# Altium schematic sheet ERN_MainPowerV2_2.SchDoc
size A; SheetNumber: 2; SheetTotal: 2; SPICEModelCacheXTMDSSOX: <root> / <DocumentId>XTMDSSOX</DocumentId> / <CacheFrame Number="0"> / <Model Name="led2" Kind="MDL"> / <Text>*Typ RED,GREEN,YELLOW,AMBER GaAs LED: Vf=2.1V Vr=4V If=40mA trr=3uS / *LED Pinout: 1=A, 2=K / .MODEL LED2 D (IS=93.1P RS=42M N=4.61 BV=4 IBV=10U / + CJO=2.97P VJ=.75 M=.333 TT=4.32U)</Text> / </Model> / <Model Name="1n5406" Kind="MDL"> / <Text>*1N5406 MCE / *600V 3A Si Rectifier pkg:DO-201 1,2 / .MODEL 1N5406 D(IS=2.68E-12 RS=0.00731 N=1.17 TT=1.44E-5 CJO=1.24E-10 / + VJ=0.6 M=0.333 BV=900 IBV=1E-5 )</Text> / </Model> / </CacheFrame> / </root>
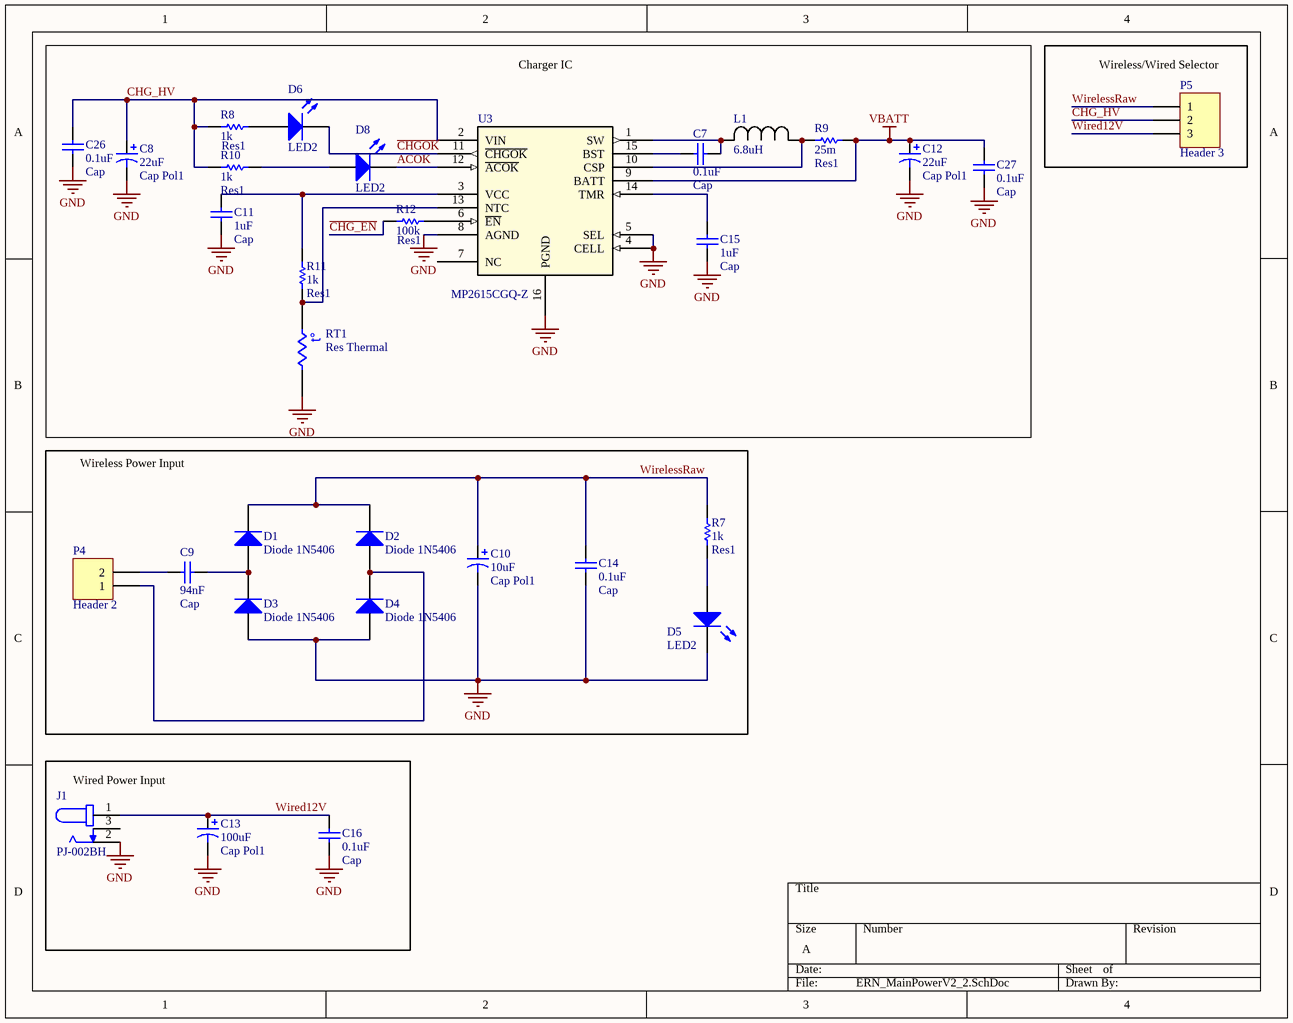
[diagram p0: ERN_MainPowerV2_2.SchDoc]

## Parts
C7  Cap  value 0.1uF  [C0805]
C8  Cap Pol1  value 22uF  [Cap_47uF_100uF]
C9  Cap  value 94nF  [C1210]
C10  Cap Pol1  value 10uF  [Cap_47uF_100uF]
C11  Cap  value 1uF  [C0805]
C12  Cap Pol1  value 22uF  [Cap_47uF_100uF]
C13  Cap Pol1  value 100uF  [Cap_47uF_100uF]
C14  Cap  value 0.1uF  [RAD-0.3]
C15  Cap  value 1uF  [C0805]
C16  Cap  value 0.1uF  [RAD-0.3]
C26  Cap  value 0.1uF  [C0805]
C27  Cap  value 0.1uF  [rad-0.3]
D1  Diode 1N5406  [DO-201AD]
D2  Diode 1N5406  [DO-201AD]
D3  Diode 1N5406  [DO-201AD]
D4  Diode 1N5406  [DO-201AD]
D5  LED2  [led-0]
D6  LED2  [led-0]
D8  LED2  [led-0]
J1  PJ-002BH  [CUI_PJ-002BH]
L1  6.8uH  [IND_VLS6045EX-6R8M]
P4  Header 2  [HDR1X2]
P5  Header 3  [HDR1X3]
R7  Res1  value 1k  [AXIAL-0.3]
R8  Res1  value 1k  [AXIAL-0.3]
R9  Res1  value 25m  [RESC6432X90N]
R10  Res1  value 1k  [AXIAL-0.3]
R11  Res1  value 1k  [AXIAL-0.3]
R12  Res1  value 100k  [AXIAL-0.3]
RT1  Res Thermal  [AXIAL-0.3]
U3  MP2615CGQ-Z  [QFN-16_3MM×3MM_MNP_MPS]

## Blocks framed on the sheet
Charger IC: C7 C8 C11 C12 C15 C26 C27 D6 D8 L1 R8-R12 RT1 U3
Wireless/Wired Selector: P5
Wireless Power Input: C9 C10 C14 D1-D5 P4 R7
Wired Power Input: C13 C16 J1

## Nets
GND: C8.2 C10.2 C11.1 C12.2 C13.2 C14.2 C15.2 C16.2 C26.1 C27.2 D3.1(A) D4.1(A) D5.2(K) J1.2 RT1.2 U3.4(CELL) U3.5(SEL) U3.8(AGND) U3.16(PGND)
VBATT: C12.1 C27.1 R9.2 U3.9(BATT)
~{ACOK}: D8.2(K) U3.12(~{ACOK})
~{CHG_EN}: R12.2
~{CHGOK}: D6.2(K) U3.11(~{CHGOK})
CHG_HV: C8.1 C26.2 P5.2 R8.2 R10.2 U3.2(VIN)
Wired12V: C13.1 C16.1 J1.1 P5.3
WirelessRaw: C10.1 C14.1 D1.2(K) D2.2(K) P5.1 R7.2
NetC7_1: C7.1 U3.15(BST)
NetC7_2: C7.2 L1.2 U3.1(SW)
NetC9_1: C9.1 P4.2
NetC9_2: C9.2 D1.1(A) D3.2(K)
NetC11_2: C11.2 R11.1 U3.3(VCC)
NetC15_1: C15.1 U3.14(TMR)
NetD2_1: D2.1(A) D4.2(K) P4.1
NetD5_1: D5.1(A) R7.1
NetD6_1: D6.1(A) R8.1
NetD8_1: D8.1(A) R10.1
NetL1_1: L1.1 R9.1 U3.10(CSP)
NetR11_2: R11.2 RT1.1 U3.13(NTC)
NetR12_1: R12.1 U3.6(~{EN})

Not connected (* = marked no-connect by the designer): J1 3; U3 7(NC)

## Notes on the sheet
- (in symbol Res Thermal) t°

## Library data of the parts
C7 C9 C11 C14-C16 C26 C27 = Cap: Capacitor; Published: 8-Jun-2000; LatestRevisionDate: 17-Jul-2002; LatestRevisionNote: Re-released for DXP Platform.; PackageReference: RAD-0.3; Publisher: Altium Limited; PackageDescription: Radial Cap, Thru-Hole; 2 Leads; 0.3 in Pin Spacing
C8 C10 C12 C13 = Cap Pol1: Polarized Capacitor (Radial); Published: 8-Jun-2000; LatestRevisionDate: 17-Jul-2002; LatestRevisionNote: Re-released for DXP Platform.; PackageReference: RB7.6-15; Publisher: Altium Limited; PackageDescription: Polarized Capacitor (Radial); 2 Leads
D1-D4 = Diode 1N5406: 3 Amp General Purpose Rectifier; Published: 8-Jun-2000; LatestRevisionDate: 17-Jul-2002; LatestRevisionNote: Re-released for DXP Platform.; DatasheetVersion: 1998; PackageVersion: Aug-1999; PackageReference: DO-201AD; Publisher: Altium Limited; PackageDescription: Diode, Axial; Body 9.5 x 5.6 mm (LxDia. max), Lead Dia. 1.32 mm (max); ComponentLink1Description: Manufacturer Link; ComponentLink1URL: http://www.fairchildsemi.com/; ComponentLink2Description: Datasheet; ComponentLink2URL: http://www.fairchildsemi.com/ds/1N%2F1N5400.pdf
D5 D6 D8 = LED2: Typical RED, GREEN, YELLOW, AMBER GaAs LED; Published: 8-Jun-2000; LatestRevisionDate: 17-Jul-2002; LatestRevisionNote: Re-released for DXP Platform.; PackageVersion: Feb-2002; PackageReference: 3.2X1.6X1.1; Publisher: Altium Limited; PackageDescription: SM LED; 2 Flat Leads
J1 = PJ-002BH: 2.5 x 6.5 mm, 5.0 A, Horizontal, Through Hole, Dc Power Jack Connector; MF: Same Sky; SnapEDA_Link: https://www.snapeda.com/parts/PJ-002BH/Same+Sky/view-part/?ref=snap; Package: None; Value: *; MP: PJ-002BH; Check_prices: https://www.snapeda.com/parts/PJ-002BH/Same+Sky/view-part/?ref=eda
L1 = 2111-V-RC: Inductor 68uH; Manufacturer_Name: Bourns Electronics; Copyright: Copyright (C) 2026 Ultra Librarian. All rights reserved.; Manufacturer_Part_Number: 2111-V-RC
P4 = Header 2: Header, 2-Pin; LatestRevisionDate: 17-Jul-2002; LatestRevisionNote: Re-released for DXP Platform.; Publisher: Altium Limited
P5 = Header 3: Header, 3-Pin; LatestRevisionDate: 17-Jul-2002; LatestRevisionNote: Re-released for DXP Platform.; Publisher: Altium Limited
R7-R12 = Res1: Resistor; Published: 8-Jun-2000; LatestRevisionDate: 17-Jul-2002; LatestRevisionNote: Re-released for DXP Platform.; PackageReference: AXIAL-0.3; Publisher: Altium Limited; PackageDescription: Axial Device, Thru-Hole; 2 Leads; 0.3 in Pin Spacing
RT1 = Res Thermal: Thermistor; Published: 24-Mar-1999; LatestRevisionDate: 29-May-2009; LatestRevisionNote: IPC-7351 Footprint Added.; PackageVersion: Mar-2003; PackageReference: 6-0805; Publisher: Altium Limited; PackageDescription: Chip Resistor 0805 Case Size; Code_IPC: RESC2012
U3 = MP2615CGQ-Z: 2.1A 1- or 2-Cell Li-ion Battery Charger with 25mohm Rsns; Manufacturer_Name: Monolithic Power Systems; Copyright: Copyright (C) 2026 Ultra Librarian. All rights reserved.; Manufacturer_Part_Number: MP2615CGQ-Z; RefDes: RefDes; Type: Type